# Altium schematic sheet 键盘扫描.SchDoc
size A2; Author: NekokeCore; DrawnBy: NekokeCore; SheetNumber: 3; SheetTotal: 3
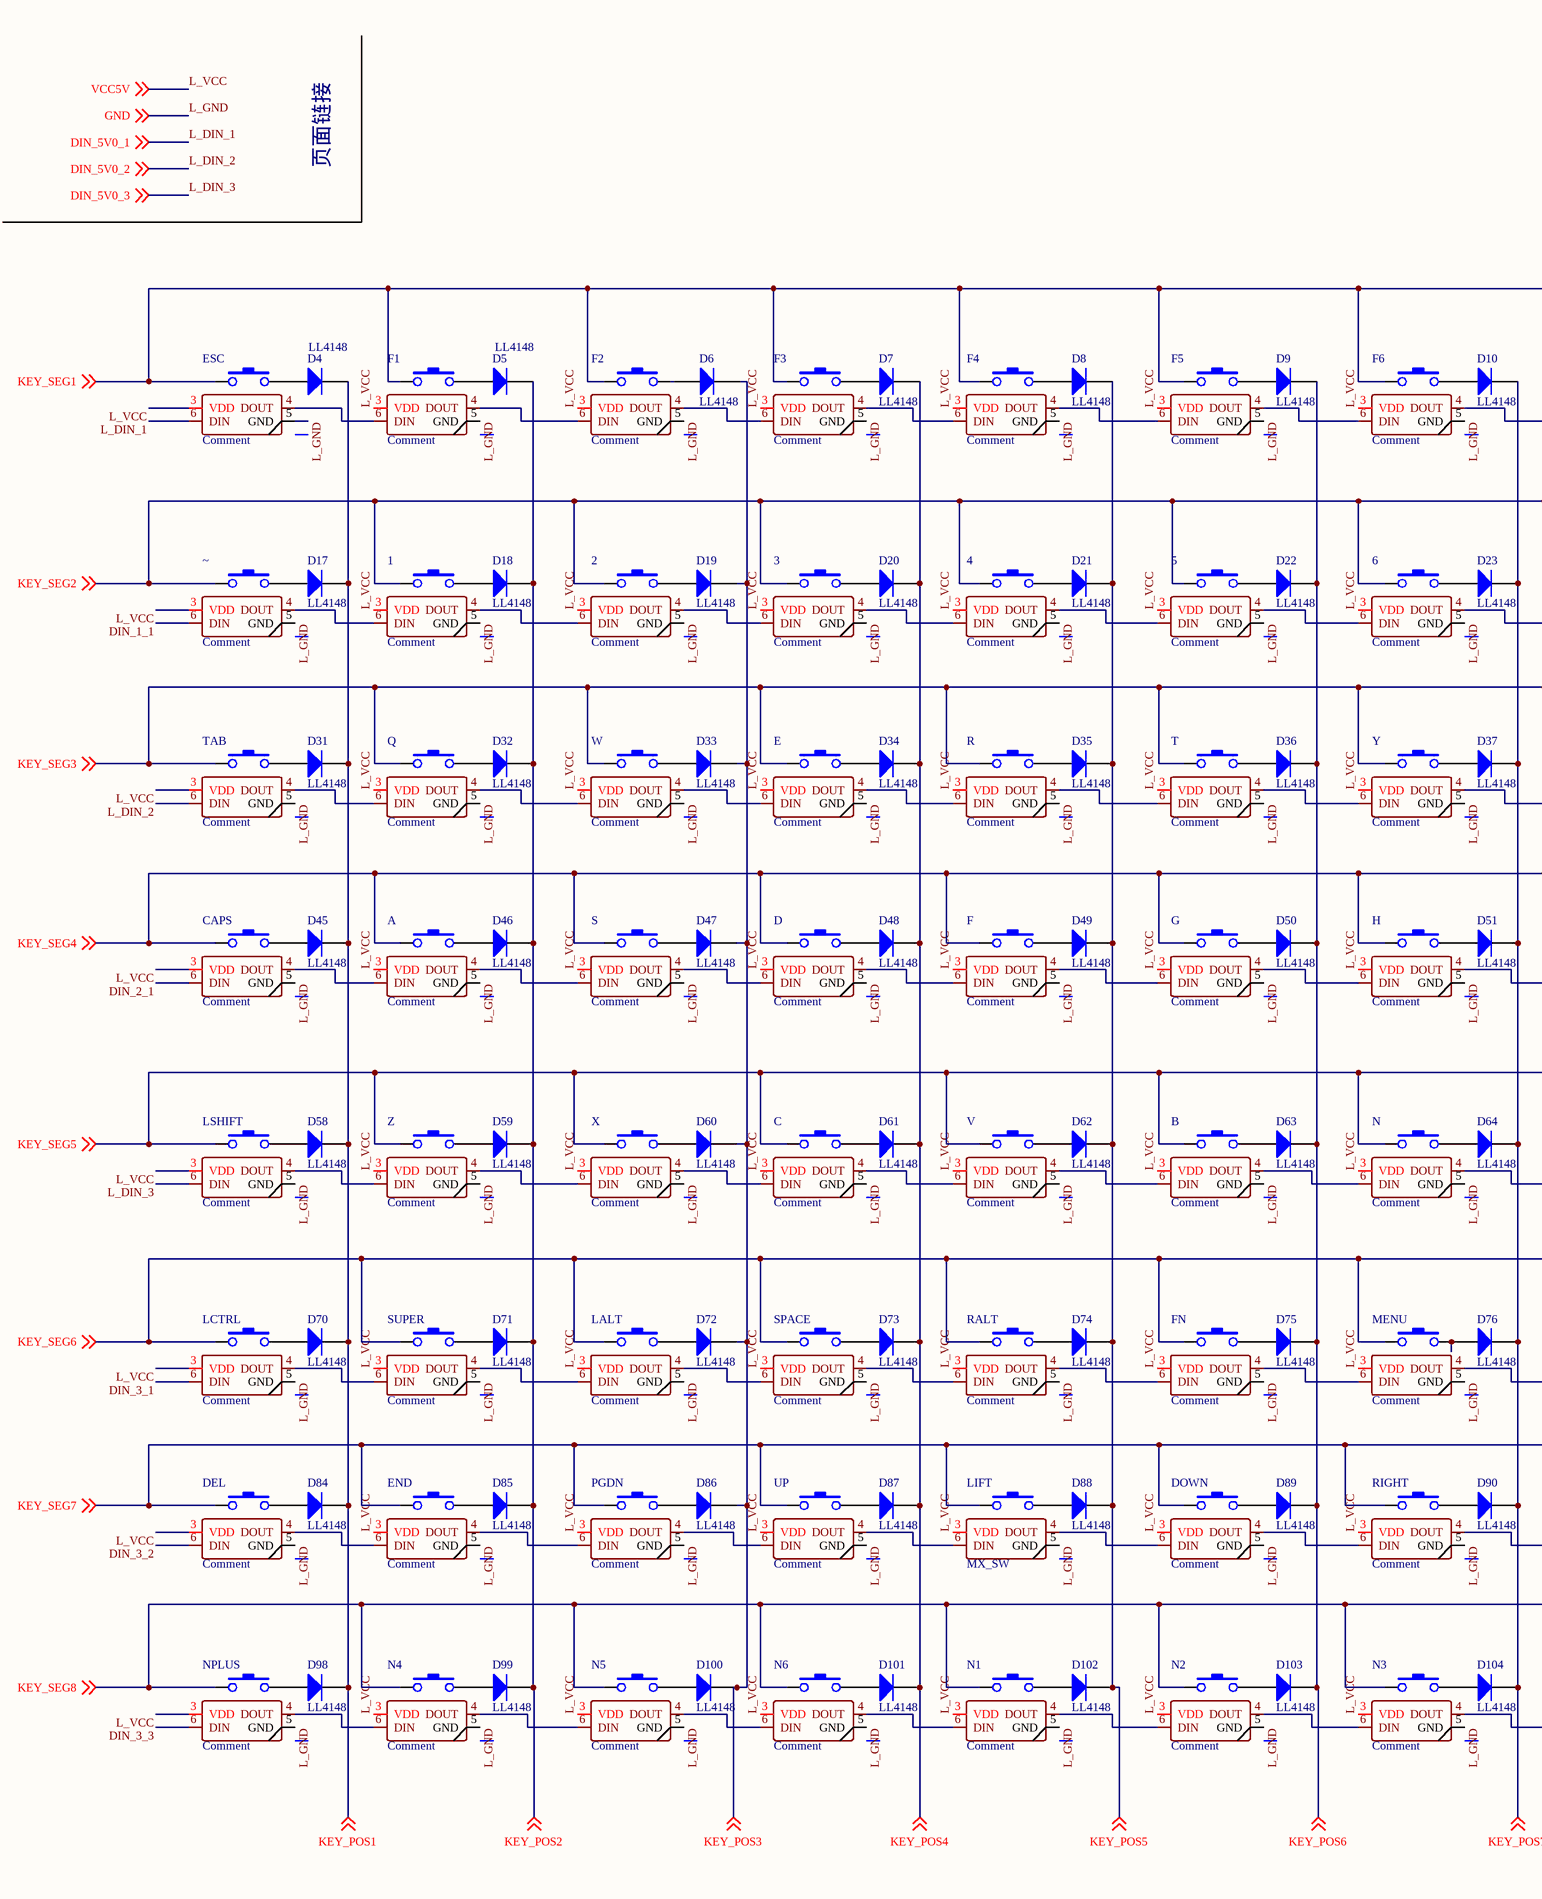
[diagram p0: 键盘扫描.SchDoc, left]
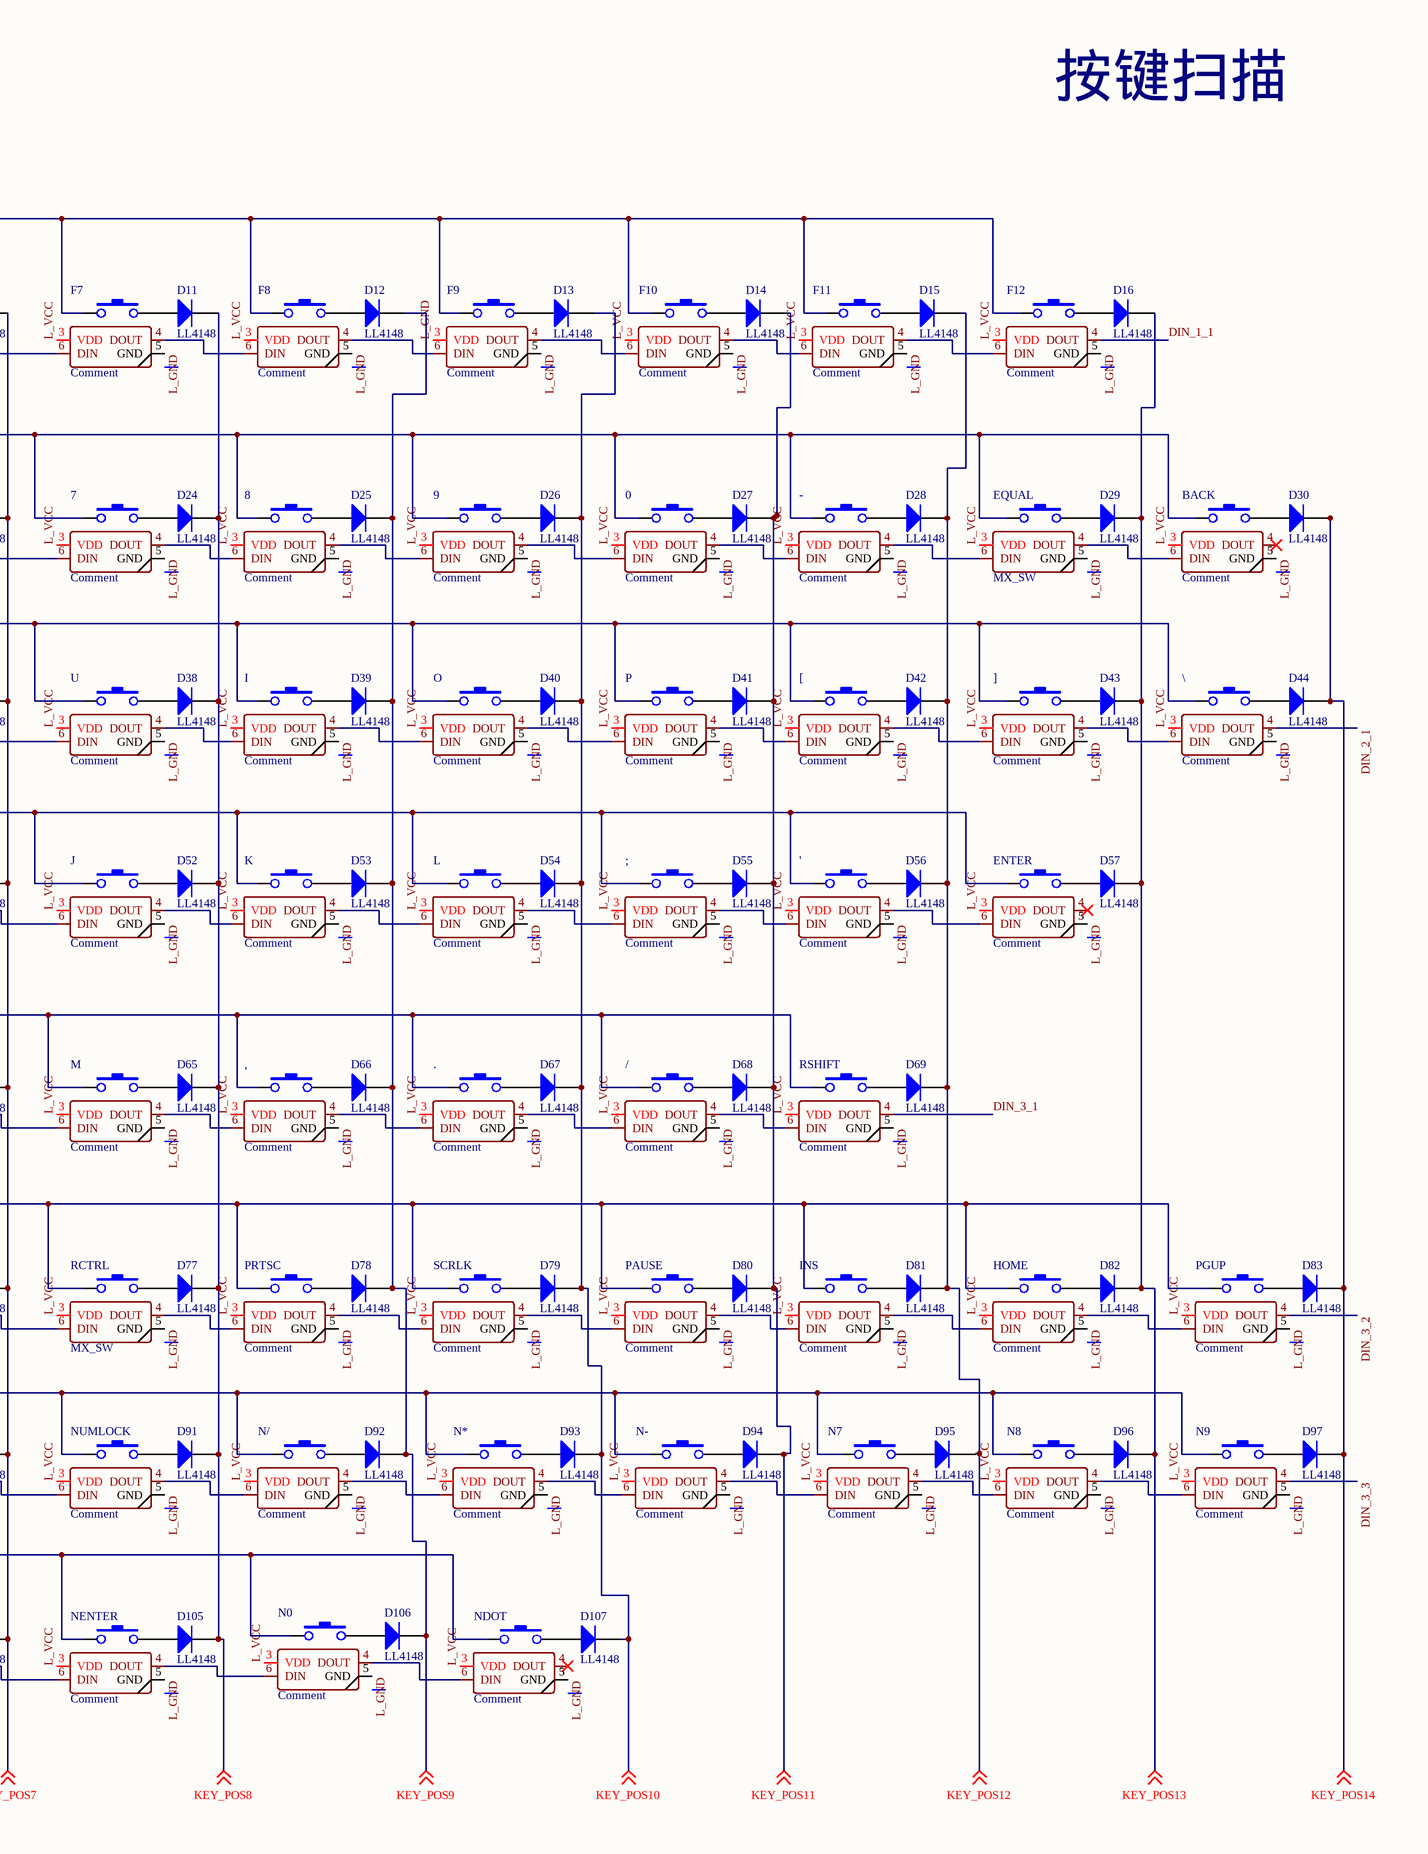
[diagram p1: 键盘扫描.SchDoc, right]

## Parts
0  Comment  [MX_SW-1]
1  Comment  [MX_SW-1]
2  Comment  [MX_SW-1]
3  Comment  [MX_SW-1]
4  Comment  [MX_SW-1]
5  Comment  [MX_SW-1]
6  Comment  [MX_SW-1]
7  Comment  [MX_SW-1]
8  Comment  [MX_SW-1]
9  Comment  [MX_SW-1]
'  Comment  [MX_SW-1]
,  Comment  [MX_SW-1]
-  Comment  [MX_SW-1]
.  Comment  [MX_SW-1]
/  Comment  [MX_SW-1]
;  Comment  [MX_SW-1]
[  Comment  [MX_SW-1]
\  Comment  [MX_SW-1]
]  Comment  [MX_SW-1]
A  Comment  [MX_SW-1]
B  Comment  [MX_SW-1]
BACK  Comment  [MX_SW-1]
C  Comment  [MX_SW-1]
CAPS  Comment  [MX_SW-1]
D  Comment  [MX_SW-1]
D4  LL4148  [LL-34_L3.7-W1.6-RD]
D5  LL4148  [LL-34_L3.7-W1.6-RD]
D6  LL4148  [LL-34_L3.7-W1.6-RD]
D7  LL4148  [LL-34_L3.7-W1.6-RD]
D8  LL4148  [LL-34_L3.7-W1.6-RD]
D9  LL4148  [LL-34_L3.7-W1.6-RD]
D10  LL4148  [LL-34_L3.7-W1.6-RD]
D11  LL4148  [LL-34_L3.7-W1.6-RD]
D12  LL4148  [LL-34_L3.7-W1.6-RD]
D13  LL4148  [LL-34_L3.7-W1.6-RD]
D14  LL4148  [LL-34_L3.7-W1.6-RD]
D15  LL4148  [LL-34_L3.7-W1.6-RD]
D16  LL4148  [LL-34_L3.7-W1.6-RD]
D17  LL4148  [LL-34_L3.7-W1.6-RD]
D18  LL4148  [LL-34_L3.7-W1.6-RD]
D19  LL4148  [LL-34_L3.7-W1.6-RD]
D20  LL4148  [LL-34_L3.7-W1.6-RD]
D21  LL4148  [LL-34_L3.7-W1.6-RD]
D22  LL4148  [LL-34_L3.7-W1.6-RD]
D23  LL4148  [LL-34_L3.7-W1.6-RD]
D24  LL4148  [LL-34_L3.7-W1.6-RD]
D25  LL4148  [LL-34_L3.7-W1.6-RD]
D26  LL4148  [LL-34_L3.7-W1.6-RD]
D27  LL4148  [LL-34_L3.7-W1.6-RD]
D28  LL4148  [LL-34_L3.7-W1.6-RD]
D29  LL4148  [LL-34_L3.7-W1.6-RD]
D30  LL4148  [LL-34_L3.7-W1.6-RD]
D31  LL4148  [LL-34_L3.7-W1.6-RD]
D32  LL4148  [LL-34_L3.7-W1.6-RD]
D33  LL4148  [LL-34_L3.7-W1.6-RD]
D34  LL4148  [LL-34_L3.7-W1.6-RD]
D35  LL4148  [LL-34_L3.7-W1.6-RD]
D36  LL4148  [LL-34_L3.7-W1.6-RD]
D37  LL4148  [LL-34_L3.7-W1.6-RD]
D38  LL4148  [LL-34_L3.7-W1.6-RD]
D39  LL4148  [LL-34_L3.7-W1.6-RD]
D40  LL4148  [LL-34_L3.7-W1.6-RD]
D41  LL4148  [LL-34_L3.7-W1.6-RD]
D42  LL4148  [LL-34_L3.7-W1.6-RD]
D43  LL4148  [LL-34_L3.7-W1.6-RD]
D44  LL4148  [LL-34_L3.7-W1.6-RD]
D45  LL4148  [LL-34_L3.7-W1.6-RD]
D46  LL4148  [LL-34_L3.7-W1.6-RD]
D47  LL4148  [LL-34_L3.7-W1.6-RD]
D48  LL4148  [LL-34_L3.7-W1.6-RD]
D49  LL4148  [LL-34_L3.7-W1.6-RD]
D50  LL4148  [LL-34_L3.7-W1.6-RD]
D51  LL4148  [LL-34_L3.7-W1.6-RD]
D52  LL4148  [LL-34_L3.7-W1.6-RD]
D53  LL4148  [LL-34_L3.7-W1.6-RD]
D54  LL4148  [LL-34_L3.7-W1.6-RD]
D55  LL4148  [LL-34_L3.7-W1.6-RD]
D56  LL4148  [LL-34_L3.7-W1.6-RD]
D57  LL4148  [LL-34_L3.7-W1.6-RD]
D58  LL4148  [LL-34_L3.7-W1.6-RD]
D59  LL4148  [LL-34_L3.7-W1.6-RD]
D60  LL4148  [LL-34_L3.7-W1.6-RD]
D61  LL4148  [LL-34_L3.7-W1.6-RD]
D62  LL4148  [LL-34_L3.7-W1.6-RD]
D63  LL4148  [LL-34_L3.7-W1.6-RD]
D64  LL4148  [LL-34_L3.7-W1.6-RD]
D65  LL4148  [LL-34_L3.7-W1.6-RD]
D66  LL4148  [LL-34_L3.7-W1.6-RD]
D67  LL4148  [LL-34_L3.7-W1.6-RD]
D68  LL4148  [LL-34_L3.7-W1.6-RD]
D69  LL4148  [LL-34_L3.7-W1.6-RD]
D70  LL4148  [LL-34_L3.7-W1.6-RD]
D71  LL4148  [LL-34_L3.7-W1.6-RD]
D72  LL4148  [LL-34_L3.7-W1.6-RD]
D73  LL4148  [LL-34_L3.7-W1.6-RD]
D74  LL4148  [LL-34_L3.7-W1.6-RD]
D75  LL4148  [LL-34_L3.7-W1.6-RD]
D76  LL4148  [LL-34_L3.7-W1.6-RD]
D77  LL4148  [LL-34_L3.7-W1.6-RD]
D78  LL4148  [LL-34_L3.7-W1.6-RD]
D79  LL4148  [LL-34_L3.7-W1.6-RD]
D80  LL4148  [LL-34_L3.7-W1.6-RD]
D81  LL4148  [LL-34_L3.7-W1.6-RD]
D82  LL4148  [LL-34_L3.7-W1.6-RD]
D83  LL4148  [LL-34_L3.7-W1.6-RD]
D84  LL4148  [LL-34_L3.7-W1.6-RD]
D85  LL4148  [LL-34_L3.7-W1.6-RD]
D86  LL4148  [LL-34_L3.7-W1.6-RD]
D87  LL4148  [LL-34_L3.7-W1.6-RD]
D88  LL4148  [LL-34_L3.7-W1.6-RD]
D89  LL4148  [LL-34_L3.7-W1.6-RD]
D90  LL4148  [LL-34_L3.7-W1.6-RD]
D91  LL4148  [LL-34_L3.7-W1.6-RD]
D92  LL4148  [LL-34_L3.7-W1.6-RD]
D93  LL4148  [LL-34_L3.7-W1.6-RD]
D94  LL4148  [LL-34_L3.7-W1.6-RD]
D95  LL4148  [LL-34_L3.7-W1.6-RD]
D96  LL4148  [LL-34_L3.7-W1.6-RD]
D97  LL4148  [LL-34_L3.7-W1.6-RD]
D98  LL4148  [LL-34_L3.7-W1.6-RD]
D99  LL4148  [LL-34_L3.7-W1.6-RD]
D100  LL4148  [LL-34_L3.7-W1.6-RD]
D101  LL4148  [LL-34_L3.7-W1.6-RD]
D102  LL4148  [LL-34_L3.7-W1.6-RD]
D103  LL4148  [LL-34_L3.7-W1.6-RD]
D104  LL4148  [LL-34_L3.7-W1.6-RD]
D105  LL4148  [LL-34_L3.7-W1.6-RD]
D106  LL4148  [LL-34_L3.7-W1.6-RD]
D107  LL4148  [LL-34_L3.7-W1.6-RD]
DEL  Comment  [MX_SW-1]
DOWN  Comment  [MX_SW-1]
E  Comment  [MX_SW-1]
END  Comment  [MX_SW-1]
ENTER  Comment  [MX_SW-1]
EQUAL  MX_SW  [MX_SW-1]
ESC  Comment  [MX_SW-1]
F  Comment  [MX_SW-1]
F1  Comment  [MX_SW-1]
F2  Comment  [MX_SW-1]
F3  Comment  [MX_SW-1]
F4  Comment  [MX_SW-1]
F5  Comment  [MX_SW-1]
F6  Comment  [MX_SW-1]
F7  Comment  [MX_SW-1]
F8  Comment  [MX_SW-1]
F9  Comment  [MX_SW-1]
F10  Comment  [MX_SW-1]
F11  Comment  [MX_SW-1]
F12  Comment  [MX_SW-1]
FN  Comment  [MX_SW-1]
G  Comment  [MX_SW-1]
H  Comment  [MX_SW-1]
HOME  Comment  [MX_SW-1]
I  Comment  [MX_SW-1]
INS  Comment  [MX_SW-1]
J  Comment  [MX_SW-1]
K  Comment  [MX_SW-1]
L  Comment  [MX_SW-1]
LALT  Comment  [MX_SW-1]
LCTRL  Comment  [MX_SW-1]
LIFT  MX_SW  [MX_SW-1]
LSHIFT  Comment  [MX_SW-1]
M  Comment  [MX_SW-1]
MENU  Comment  [MX_SW-1]
N  Comment  [MX_SW-1]
N0  Comment  [MX_SW-1]
N1  Comment  [MX_SW-1]
N2  Comment  [MX_SW-1]
N3  Comment  [MX_SW-1]
N4  Comment  [MX_SW-1]
N5  Comment  [MX_SW-1]
N6  Comment  [MX_SW-1]
N7  Comment  [MX_SW-1]
N8  Comment  [MX_SW-1]
N9  Comment  [MX_SW-1]
N*  Comment  [MX_SW-1]
N-  Comment  [MX_SW-1]
N/  Comment  [MX_SW-1]
NDOT  Comment  [MX_SW-1]
NENTER  Comment  [MX_SW-1]
NPLUS  Comment  [MX_SW-1]
NUMLOCK  Comment  [MX_SW-1]
O  Comment  [MX_SW-1]
P  Comment  [MX_SW-1]
PAUSE  Comment  [MX_SW-1]
PGDN  Comment  [MX_SW-1]
PGUP  Comment  [MX_SW-1]
PRTSC  Comment  [MX_SW-1]
Q  Comment  [MX_SW-1]
R  Comment  [MX_SW-1]
RALT  Comment  [MX_SW-1]
RCTRL  MX_SW  [MX_SW-1]
RIGHT  Comment  [MX_SW-1]
RSHIFT  Comment  [MX_SW-1]
S  Comment  [MX_SW-1]
SCRLK  Comment  [MX_SW-1]
SPACE  Comment  [MX_SW-1]
SUPER  Comment  [MX_SW-1]
T  Comment  [MX_SW-1]
TAB  Comment  [MX_SW-1]
U  Comment  [MX_SW-1]
UP  Comment  [MX_SW-1]
V  Comment  [MX_SW-1]
W  Comment  [MX_SW-1]
X  Comment  [MX_SW-1]
Y  Comment  [MX_SW-1]
Z  Comment  [MX_SW-1]
~  Comment  [MX_SW-1]

## Nets
DIN_1_1: F12.4(DOUT) ~.6(DIN)
DIN_2_1: \.4(DOUT) CAPS.6(DIN)
DIN_3_1: LCTRL.6(DIN) RSHIFT.4(DOUT)
DIN_3_2: DEL.6(DIN) PGUP.4(DOUT)
DIN_3_3: N9.4(DOUT) NPLUS.6(DIN)
KEY_POS1: D4.2(K) D17.2(K) D31.2(K) D45.2(K) D58.2(K) D70.2(K) D84.2(K) D98.2(K) ; off-sheet KEY_POS1
KEY_POS2: D5.2(K) D18.2(K) D32.2(K) D46.2(K) D59.2(K) D71.2(K) D85.2(K) D99.2(K) ; off-sheet KEY_POS2
KEY_POS3: D6.2(K) D19.2(K) D33.2(K) D47.2(K) D60.2(K) D72.2(K) D86.2(K) D100.2(K) ; off-sheet KEY_POS3
KEY_POS4: D7.2(K) D20.2(K) D34.2(K) D48.2(K) D61.2(K) D73.2(K) D87.2(K) D101.2(K) ; off-sheet KEY_POS4
KEY_POS5: D8.2(K) D21.2(K) D35.2(K) D49.2(K) D62.2(K) D74.2(K) D88.2(K) D102.2(K) ; off-sheet KEY_POS5
KEY_POS6: D9.2(K) D22.2(K) D36.2(K) D50.2(K) D63.2(K) D75.2(K) D89.2(K) D103.2(K) ; off-sheet KEY_POS6
KEY_POS7: D10.2(K) D23.2(K) D37.2(K) D51.2(K) D64.2(K) D76.2(K) D90.2(K) D104.2(K) ; off-sheet KEY_POS7
KEY_POS8: D11.2(K) D24.2(K) D38.2(K) D52.2(K) D65.2(K) D77.2(K) D91.2(K) D105.2(K) ; off-sheet KEY_POS8
KEY_POS9: D12.2(K) D25.2(K) D39.2(K) D53.2(K) D66.2(K) D78.2(K) D92.2(K) D106.2(K) ; off-sheet KEY_POS9
KEY_POS10: D13.2(K) D26.2(K) D40.2(K) D54.2(K) D67.2(K) D79.2(K) D93.2(K) D107.2(K) ; off-sheet KEY_POS10
KEY_POS11: D14.2(K) D27.2(K) D41.2(K) D55.2(K) D68.2(K) D80.2(K) D94.2(K) ; off-sheet KEY_POS11
KEY_POS12: D15.2(K) D28.2(K) D42.2(K) D56.2(K) D69.2(K) D81.2(K) D95.2(K) ; off-sheet KEY_POS12
KEY_POS13: D16.2(K) D29.2(K) D43.2(K) D57.2(K) D82.2(K) D96.2(K) ; off-sheet KEY_POS13
KEY_POS14: D30.2(K) D44.2(K) D83.2(K) D97.2(K) ; off-sheet KEY_POS14
KEY_SEG1: ESC.1 F1.1 F2.1 F3.1 F4.1 F5.1 F6.1 F7.1 F8.1 F9.1 F10.1 F11.1 F12.1 ; off-sheet KEY_SEG1
KEY_SEG2: 0.1 1.1 2.1 3.1 4.1 5.1 6.1 7.1 8.1 9.1 -.1 BACK.1 EQUAL.1 ~.1 ; off-sheet KEY_SEG2
KEY_SEG3: [.1 \.1 ].1 E.1 I.1 O.1 P.1 Q.1 R.1 T.1 TAB.1 U.1 W.1 Y.1 ; off-sheet KEY_SEG3
KEY_SEG4: '.1 ;.1 A.1 CAPS.1 D.1 ENTER.1 F.1 G.1 H.1 J.1 K.1 L.1 S.1 ; off-sheet KEY_SEG4
KEY_SEG5: ,.1 ..1 /.1 B.1 C.1 LSHIFT.1 M.1 N.1 RSHIFT.1 V.1 X.1 Z.1 ; off-sheet KEY_SEG5
KEY_SEG6: FN.1 HOME.1 INS.1 LALT.1 LCTRL.1 MENU.1 PAUSE.1 PGUP.1 PRTSC.1 RALT.1 RCTRL.1 SCRLK.1 SPACE.1 SUPER.1 ; off-sheet KEY_SEG6
KEY_SEG7: DEL.1 DOWN.1 END.1 LIFT.1 N7.1 N8.1 N9.1 N*.1 N-.1 N/.1 NUMLOCK.1 PGDN.1 RIGHT.1 UP.1 ; off-sheet KEY_SEG7
KEY_SEG8: N0.1 N1.1 N2.1 N3.1 N4.1 N5.1 N6.1 NDOT.1 NENTER.1 NPLUS.1 ; off-sheet KEY_SEG8
L_DIN_1: ESC.6(DIN) ; off-sheet DIN_5V0_1  [also labelled DIN_5V0_1]
L_DIN_2: TAB.6(DIN) ; off-sheet DIN_5V0_2  [also labelled DIN_5V0_2]
L_DIN_3: LSHIFT.6(DIN) ; off-sheet DIN_5V0_3  [also labelled DIN_5V0_3]
L_GND: 0.5(GND) 1.5(GND) 2.5(GND) 3.5(GND) 4.5(GND) 5.5(GND) 6.5(GND) 7.5(GND) 8.5(GND) 9.5(GND) '.5(GND) ,.5(GND) -.5(GND) ..5(GND) /.5(GND) ;.5(GND) [.5(GND) \.5(GND) ].5(GND) A.5(GND) B.5(GND) BACK.5(GND) C.5(GND) CAPS.5(GND) D.5(GND) DEL.5(GND) DOWN.5(GND) E.5(GND) END.5(GND) ENTER.5(GND) EQUAL.5(GND) ESC.5(GND) F.5(GND) F1.5(GND) F2.5(GND) F3.5(GND) F4.5(GND) F5.5(GND) F6.5(GND) F7.5(GND) F8.5(GND) F9.3(VDD) F9.5(GND) F10.5(GND) F11.5(GND) F12.5(GND) FN.5(GND) G.5(GND) H.5(GND) HOME.5(GND) I.5(GND) INS.5(GND) J.5(GND) K.5(GND) L.5(GND) LALT.5(GND) LCTRL.5(GND) LIFT.5(GND) LSHIFT.5(GND) M.5(GND) MENU.5(GND) N.5(GND) N0.5(GND) N1.5(GND) N2.5(GND) N3.5(GND) N4.5(GND) N5.5(GND) N6.5(GND) N7.5(GND) N8.5(GND) N9.5(GND) N*.5(GND) N-.5(GND) N/.5(GND) NDOT.5(GND) NENTER.5(GND) NPLUS.5(GND) NUMLOCK.5(GND) O.5(GND) P.5(GND) PAUSE.5(GND) PGDN.5(GND) PGUP.5(GND) PRTSC.5(GND) Q.5(GND) R.5(GND) RALT.5(GND) RCTRL.5(GND) RIGHT.5(GND) RSHIFT.5(GND) S.5(GND) SCRLK.5(GND) SPACE.5(GND) SUPER.5(GND) T.5(GND) TAB.5(GND) U.5(GND) UP.5(GND) V.5(GND) W.5(GND) X.5(GND) Y.5(GND) Z.5(GND) ~.5(GND) ; off-sheet GND  [also labelled GND]
L_VCC: 0.3(VDD) 1.3(VDD) 2.3(VDD) 3.3(VDD) 4.3(VDD) 5.3(VDD) 6.3(VDD) 7.3(VDD) 8.3(VDD) 9.3(VDD) '.3(VDD) ,.3(VDD) -.3(VDD) ..3(VDD) /.3(VDD) ;.3(VDD) [.3(VDD) \.3(VDD) ].3(VDD) A.3(VDD) B.3(VDD) BACK.3(VDD) C.3(VDD) CAPS.3(VDD) D.3(VDD) DEL.3(VDD) DOWN.3(VDD) E.3(VDD) END.3(VDD) ENTER.3(VDD) EQUAL.3(VDD) ESC.3(VDD) F.3(VDD) F1.3(VDD) F2.3(VDD) F3.3(VDD) F4.3(VDD) F5.3(VDD) F6.3(VDD) F7.3(VDD) F8.3(VDD) F10.3(VDD) F11.3(VDD) F12.3(VDD) FN.3(VDD) G.3(VDD) H.3(VDD) HOME.3(VDD) I.3(VDD) INS.3(VDD) J.3(VDD) K.3(VDD) L.3(VDD) LALT.3(VDD) LCTRL.3(VDD) LIFT.3(VDD) LSHIFT.3(VDD) M.3(VDD) MENU.3(VDD) N.3(VDD) N0.3(VDD) N1.3(VDD) N2.3(VDD) N3.3(VDD) N4.3(VDD) N5.3(VDD) N6.3(VDD) N7.3(VDD) N8.3(VDD) N9.3(VDD) N*.3(VDD) N-.3(VDD) N/.3(VDD) NDOT.3(VDD) NENTER.3(VDD) NPLUS.3(VDD) NUMLOCK.3(VDD) O.3(VDD) P.3(VDD) PAUSE.3(VDD) PGDN.3(VDD) PGUP.3(VDD) PRTSC.3(VDD) Q.3(VDD) R.3(VDD) RALT.3(VDD) RCTRL.3(VDD) RIGHT.3(VDD) RSHIFT.3(VDD) S.3(VDD) SCRLK.3(VDD) SPACE.3(VDD) SUPER.3(VDD) T.3(VDD) TAB.3(VDD) U.3(VDD) UP.3(VDD) V.3(VDD) W.3(VDD) X.3(VDD) Y.3(VDD) Z.3(VDD) ~.3(VDD) ; off-sheet VCC5V  [also labelled VCC5V]
Net0_2: 0.2 D27.1(A)
Net0_4: 0.4(DOUT) -.6(DIN)
Net0_6: 0.6(DIN) 9.4(DOUT)
Net1_2: 1.2 D18.1(A)
Net1_4: 1.4(DOUT) 2.6(DIN)
Net1_6: 1.6(DIN) ~.4(DOUT)
Net2_2: 2.2 D19.1(A)
Net2_4: 2.4(DOUT) 3.6(DIN)
Net3_2: 3.2 D20.1(A)
Net3_4: 3.4(DOUT) 4.6(DIN)
Net4_2: 4.2 D21.1(A)
Net4_4: 4.4(DOUT) 5.6(DIN)
Net5_2: 5.2 D22.1(A)
Net5_4: 5.4(DOUT) 6.6(DIN)
Net6_2: 6.2 D23.1(A)
Net6_4: 6.4(DOUT) 7.6(DIN)
Net7_2: 7.2 D24.1(A)
Net7_4: 7.4(DOUT) 8.6(DIN)
Net8_2: 8.2 D25.1(A)
Net8_4: 8.4(DOUT) 9.6(DIN)
Net9_2: 9.2 D26.1(A)
Net'_2: '.2 D56.1(A)
Net'_4: '.4(DOUT) ENTER.6(DIN)
Net'_6: '.6(DIN) ;.4(DOUT)
Net,_2: ,.2 D66.1(A)
Net,_4: ,.4(DOUT) ..6(DIN)
Net,_6: ,.6(DIN) M.4(DOUT)
Net-_2: -.2 D28.1(A)
Net-_4: -.4(DOUT) EQUAL.6(DIN)
Net._2: ..2 D67.1(A)
Net._4: ..4(DOUT) /.6(DIN)
Net/_2: /.2 D68.1(A)
Net/_4: /.4(DOUT) RSHIFT.6(DIN)
Net;_2: ;.2 D55.1(A)
Net;_6: ;.6(DIN) L.4(DOUT)
Net[_2: [.2 D42.1(A)
Net[_4: [.4(DOUT) ].6(DIN)
Net[_6: [.6(DIN) P.4(DOUT)
Ne~{t}_2: \.2 D44.1(A)
Ne~{t}_6: \.6(DIN) ].4(DOUT)
Net]_2: ].2 D43.1(A)
NetA_2: A.2 D46.1(A)
NetA_4: A.4(DOUT) S.6(DIN)
NetA_6: A.6(DIN) CAPS.4(DOUT)
NetB_2: B.2 D63.1(A)
NetB_4: B.4(DOUT) N.6(DIN)
NetB_6: B.6(DIN) V.4(DOUT)
NetBACK_2: BACK.2 D30.1(A)
NetBACK_6: BACK.6(DIN) EQUAL.4(DOUT)
NetC_2: C.2 D61.1(A)
NetC_4: C.4(DOUT) V.6(DIN)
NetC_6: C.6(DIN) X.4(DOUT)
NetCAPS_2: CAPS.2 D45.1(A)
NetD4_1: D4.1(A) ESC.2
NetD5_1: D5.1(A) F1.2
NetD6_1: D6.1(A) F2.2
NetD7_1: D7.1(A) F3.2
NetD8_1: D8.1(A) F4.2
NetD9_1: D9.1(A) F5.2
NetD10_1: D10.1(A) F6.2
NetD11_1: D11.1(A) F7.2
NetD12_1: D12.1(A) F8.2
NetD13_1: D13.1(A) F9.2
NetD14_1: D14.1(A) F10.2
NetD15_1: D15.1(A) F11.2
NetD16_1: D16.1(A) F12.2
NetD17_1: D17.1(A) ~.2
NetD29_1: D29.1(A) EQUAL.2
NetD31_1: D31.1(A) TAB.2
NetD32_1: D32.1(A) Q.2
NetD33_1: D33.1(A) W.2
NetD34_1: D34.1(A) E.2
NetD35_1: D35.1(A) R.2
NetD36_1: D36.1(A) T.2
NetD37_1: D37.1(A) Y.2
NetD38_1: D38.1(A) U.2
NetD39_1: D39.1(A) I.2
NetD40_1: D40.1(A) O.2
NetD41_1: D41.1(A) P.2
NetD47_1: D47.1(A) S.2
NetD49_1: D49.1(A) F.2
NetD50_1: D50.1(A) G.2
NetD51_1: D51.1(A) H.2
NetD52_1: D52.1(A) J.2
NetD53_1: D53.1(A) K.2
NetD54_1: D54.1(A) L.2
NetD57_1: D57.1(A) ENTER.2
NetD58_1: D58.1(A) LSHIFT.2
NetD59_1: D59.1(A) Z.2
NetD60_1: D60.1(A) X.2
NetD62_1: D62.1(A) V.2
NetD64_1: D64.1(A) N.2
NetD65_1: D65.1(A) M.2
NetD69_1: D69.1(A) RSHIFT.2
NetD70_1: D70.1(A) LCTRL.2
NetD71_1: D71.1(A) SUPER.2
NetD72_1: D72.1(A) LALT.2
NetD73_1: D73.1(A) SPACE.2
NetD74_1: D74.1(A) RALT.2
NetD75_1: D75.1(A) FN.2
NetD76_1: D76.1(A) MENU.2
NetD77_1: D77.1(A) RCTRL.2
NetD78_1: D78.1(A) PRTSC.2
NetD79_1: D79.1(A) SCRLK.2
NetD80_1: D80.1(A) PAUSE.2
NetD81_1: D81.1(A) INS.2
NetD82_1: D82.1(A) HOME.2
NetD83_1: D83.1(A) PGUP.2
NetD84_1: D84.1(A) DEL.2
NetD85_1: D85.1(A) END.2
NetD86_1: D86.1(A) PGDN.2
NetD87_1: D87.1(A) UP.2
NetD88_1: D88.1(A) LIFT.2
NetD89_1: D89.1(A) DOWN.2
NetD90_1: D90.1(A) RIGHT.2
NetD91_1: D91.1(A) NUMLOCK.2
NetD92_1: D92.1(A) N/.2
NetD93_1: D93.1(A) N*.2
NetD94_1: D94.1(A) N-.2
NetD95_1: D95.1(A) N7.2
NetD96_1: D96.1(A) N8.2
NetD97_1: D97.1(A) N9.2
NetD98_1: D98.1(A) NPLUS.2
NetD99_1: D99.1(A) N4.2
NetD100_1: D100.1(A) N5.2
NetD101_1: D101.1(A) N6.2
NetD102_1: D102.1(A) N1.2
NetD103_1: D103.1(A) N2.2
NetD104_1: D104.1(A) N3.2
NetD105_1: D105.1(A) NENTER.2
NetD106_1: D106.1(A) N0.2
NetD107_1: D107.1(A) NDOT.2
NetD_2: D.2 D48.1(A)
NetD_4: D.4(DOUT) F.6(DIN)
NetD_6: D.6(DIN) S.4(DOUT)
NetDEL_4: DEL.4(DOUT) END.6(DIN)
NetDOWN_4: DOWN.4(DOUT) RIGHT.6(DIN)
NetDOWN_6: DOWN.6(DIN) LIFT.4(DOUT)
NetE_4: E.4(DOUT) R.6(DIN)
NetE_6: E.6(DIN) W.4(DOUT)
NetEND_4: END.4(DOUT) PGDN.6(DIN)
NetESC_4: ESC.4(DOUT) F1.6(DIN)
NetF1_4: F1.4(DOUT) F2.6(DIN)
NetF2_4: F2.4(DOUT) F3.6(DIN)
NetF3_4: F3.4(DOUT) F4.6(DIN)
NetF4_4: F4.4(DOUT) F5.6(DIN)
NetF5_4: F5.4(DOUT) F6.6(DIN)
NetF6_4: F6.4(DOUT) F7.6(DIN)
NetF7_4: F7.4(DOUT) F8.6(DIN)
NetF8_4: F8.4(DOUT) F9.6(DIN)
NetF9_4: F9.4(DOUT) F10.6(DIN)
NetF10_4: F10.4(DOUT) F11.6(DIN)
NetF11_4: F11.4(DOUT) F12.6(DIN)
NetF_4: F.4(DOUT) G.6(DIN)
NetFN_4: FN.4(DOUT) MENU.6(DIN)
NetFN_6: FN.6(DIN) RALT.4(DOUT)
NetG_4: G.4(DOUT) H.6(DIN)
NetH_4: H.4(DOUT) J.6(DIN)
NetHOME_4: HOME.4(DOUT) PGUP.6(DIN)
NetHOME_6: HOME.6(DIN) INS.4(DOUT)
NetI_4: I.4(DOUT) O.6(DIN)
NetI_6: I.6(DIN) U.4(DOUT)
NetINS_6: INS.6(DIN) PAUSE.4(DOUT)
NetJ_4: J.4(DOUT) K.6(DIN)
NetK_4: K.4(DOUT) L.6(DIN)
NetLALT_4: LALT.4(DOUT) SPACE.6(DIN)
NetLALT_6: LALT.6(DIN) SUPER.4(DOUT)
NetLCTRL_4: LCTRL.4(DOUT) SUPER.6(DIN)
NetLIFT_6: LIFT.6(DIN) UP.4(DOUT)
NetLSHIFT_4: LSHIFT.4(DOUT) Z.6(DIN)
NetM_6: M.6(DIN) N.4(DOUT)
NetMENU_4: MENU.4(DOUT) RCTRL.6(DIN)
NetN0_4: N0.4(DOUT) NDOT.6(DIN)
NetN0_6: N0.6(DIN) NENTER.4(DOUT)
NetN1_4: N1.4(DOUT) N2.6(DIN)
NetN1_6: N1.6(DIN) N6.4(DOUT)
NetN2_4: N2.4(DOUT) N3.6(DIN)
NetN3_4: N3.4(DOUT) NENTER.6(DIN)
NetN4_4: N4.4(DOUT) N5.6(DIN)
NetN4_6: N4.6(DIN) NPLUS.4(DOUT)
NetN5_4: N5.4(DOUT) N6.6(DIN)
NetN7_4: N7.4(DOUT) N8.6(DIN)
NetN7_6: N7.6(DIN) N-.4(DOUT)
NetN8_4: N8.4(DOUT) N9.6(DIN)
NetN*_4: N*.4(DOUT) N-.6(DIN)
NetN*_6: N*.6(DIN) N/.4(DOUT)
NetN/_6: N/.6(DIN) NUMLOCK.4(DOUT)
NetNUMLOCK_6: NUMLOCK.6(DIN) RIGHT.4(DOUT)
NetO_4: O.4(DOUT) P.6(DIN)
NetPAUSE_6: PAUSE.6(DIN) SCRLK.4(DOUT)
NetPGDN_4: PGDN.4(DOUT) UP.6(DIN)
NetPRTSC_4: PRTSC.4(DOUT) SCRLK.6(DIN)
NetPRTSC_6: PRTSC.6(DIN) RCTRL.4(DOUT)
NetQ_4: Q.4(DOUT) W.6(DIN)
NetQ_6: Q.6(DIN) TAB.4(DOUT)
NetR_4: R.4(DOUT) T.6(DIN)
NetRALT_6: RALT.6(DIN) SPACE.4(DOUT)
NetT_4: T.4(DOUT) Y.6(DIN)
NetU_6: U.6(DIN) Y.4(DOUT)
NetX_6: X.6(DIN) Z.4(DOUT)

Not connected (* = marked no-connect by the designer): BACK 4(DOUT)*; ENTER 4(DOUT)*; NDOT 4(DOUT)*

## Notes on the sheet
- 页面链接
- 按键扫描

## Library data of the parts
0-9 ' , - . / ; [ \ ] A B BACK C CAPS D DEL DOWN E END ENTER EQUAL ESC F F1-F12 FN G H HOME I INS J K L LALT LCTRL LIFT LSHIFT M MENU N N0-N9 N* N- N/ NDOT NENTER NPLUS NUMLOCK O P PAUSE PGDN PGUP PRTSC Q R RALT RCTRL RIGHT RSHIFT S SCRLK SPACE SUPER T TAB U UP V W X Y Z ~ = MX_SW-1
D4-D107 = Diode: Default Diode; Published: 8-Jun-2000; LatestRevisionDate: 17-Jul-2002; LatestRevisionNote: Re-released for DXP Platform.; PackageVersion: Sep-1996; PackageReference: SMC; Publisher: Altium Limited; PackageDescription: DO-214-AB/SMC; 2 C-Bend Leads; Body 7.9 x 5.9 mm, inc. leads (LxW); Code_JEDEC: DO-214-AB